# Altium schematic sheet RoBeast_DC_Brake.SchDoc: DC Brake
size A4; ApprovedBy: CR; DrawnBy: VM & IG; Revision: V1; SheetNumber: 9; SheetTotal: 9
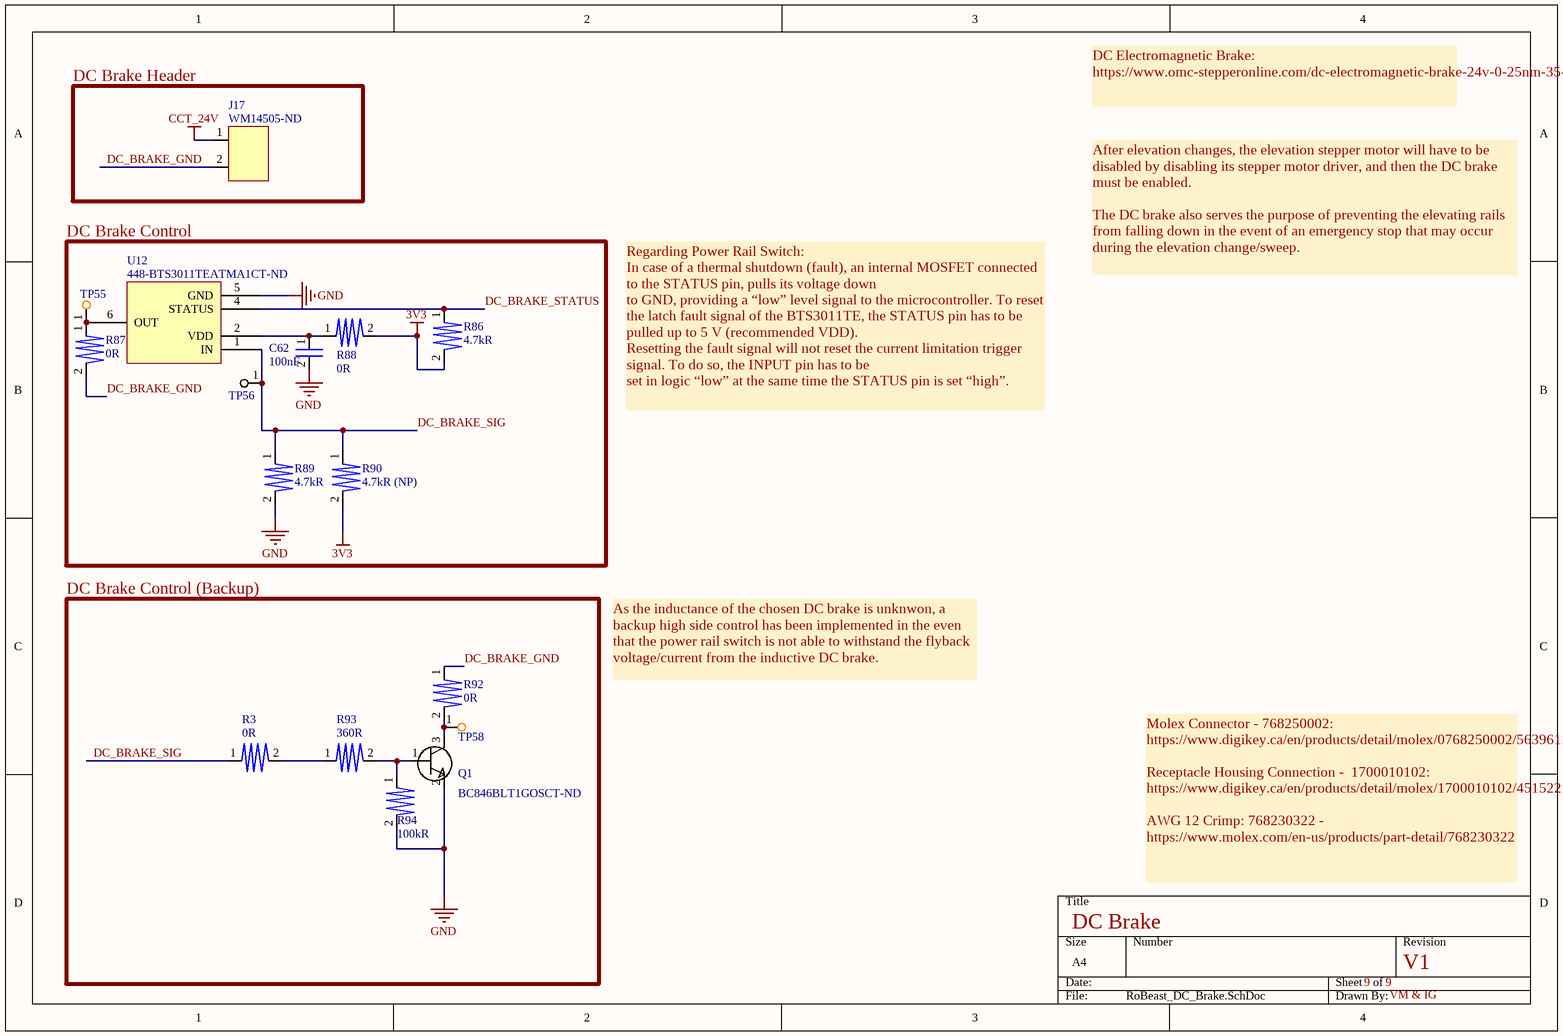
[diagram p0: RoBeast_DC_Brake.SchDoc]

## Parts
C62  100nF  [0805]
J17  2 Pin Connector  [WM14505-ND]  (value not drawn)
Q1  Supplier Part Number 1: BC846BLT1GOSCT-ND  [BC846BLT1G]  (hidden comment: NPN BJT)
R3  0R  [0805]
R86  4.7kR  [0805]
R87  0R  [0805]
R88  0R  [0805]
R89  4.7kR  [0805]
R90  4.7kR (NP)  [0805]
R92  0R  [0805]
R93  360R  [0805]
R94  100kR  [0805]
TP55  Test Point  [Test Point]  (value not drawn)
TP56  Test Point  [RCWCTE]  (value not drawn)
TP58  Test Point  [Test Point]  (value not drawn)
U12  Supplier Part Number 1: 448-BTS3011TEATMA1CT-ND  [BTS3011TEATMA1]  (hidden comment: Power Rail Switch)

## Blocks framed on the sheet
DC Brake Header: J17
DC Brake Control: C62 R86-R90 TP55 TP56 U12
DC Brake Control (Backup): Q1 R3 R92-R94 TP58

## Nets
3V3: R86.2 R88.2 R90.2
CCT_24V: J17.1
GND: C62.2 Q1.2(E) R89.2 R94.2 U12.5(GND)
DC_BRAKE_GND: J17.2 R87.2 R92.1
DC_BRAKE_SIG: R3.1 R89.1 R90.1 TP56.1 U12.1(IN)
DC_BRAKE_STATUS: R86.1 U12.4(STATUS)
NetC62_1: C62.1 R88.1 U12.2(VDD)
NetQ1_1: Q1.1(B) R93.2 R94.1
NetQ1_3: Q1.3(C) R92.2 TP58.1
NetR3_2: R3.2 R93.1
NetR87_1: R87.1 TP55.1 U12.6(OUT)

## Notes on the sheet
- DC Electromagnetic Brake: https://www.omc-stepperonline.com/dc-electromagnetic-brake-24v-0-25nm-35-4oz-in-for-nema-17-stepper-motor-swb-01
- After elevation changes, the elevation stepper motor will have to be disabled by disabling its stepper motor driver, and then the DC brake must be enabled.
  The DC brake also serves the purpose of preventing the elevating rails from falling down in the event of an emergency stop that may occur during the elevation change/sweep.
- Regarding Power Rail Switch:
  In case of a thermal shutdown (fault), an internal MOSFET connected to the STATUS pin, pulls its voltage down
  to GND, providing a “low” level signal to the microcontroller. To reset the latch fault signal of the BTS3011TE, the STATUS pin has to be pulled up to 5 V (recommended VDD).
  Resetting the fault signal will not reset the current limitation trigger signal. To do so, the INPUT pin has to be
  set in logic “low” at the same time the STATUS pin is set “high”.
- As the inductance of the chosen DC brake is unknwon, a backup high side control has been implemented in the even that the power rail switch is not able to withstand the flyback voltage/current from the inductive DC brake.
- Molex Connector - 768250002: https://www.digikey.ca/en/products/detail/molex/0768250002/5639611
  Receptacle Housing Connection -  1700010102: https://www.digikey.ca/en/products/detail/molex/1700010102/4515221
  AWG 12 Crimp: 768230322 - https://www.molex.com/en-us/products/part-detail/768230322

## Library data of the parts
C62 = C0805C104J5RAC7800: Ceramic Capacitor, Multilayer, Ceramic, 50V, 5% +Tol, 5% -Tol, X7R, 15% TC, 0.1uF, Surface Mount, 0805; Manufacturer: KEMET; Manufacturer Part Number: C0805C104J5RACTU; Multilayer: Yes; Supplier 1: Digikey; RoHS: Yes; Category: Ceramic Capacitors; Stock 1: 605061; Pricing 1: 1=0.18, 10=0.122, 50=0.0732, 100=0.0576, 500=0.04252, 1000=0.03519 (USD); Mount: Surface Mount; Number of Pins: 2; Dielectric Material: Ceramic; Package Shape: Rectangular; Size Code: 0805; Terminal Finish: Nickel; Min Operating Temperature: -55°C; Max Operating Temperature: 125°C; JESD-609 Code: e3; Capacitor Type: Ceramic; Negative Tolerance: 5%; Packaging: Tape and Reel; Positive Tolerance: 5%; Rated DC Voltage (URdc): 50V; Temperature Characteristics Code: X7R; Termination: Wraparound; Reach SVHC Compliant: Yes; RoHS Compliant: Yes; ComponentLink1URL: http://capacitoredge.kemet.com:80/capedge2/intellispec.jsp?pn=C0805C104J5RACTU&displayPN=C0805C104J5RACTU&src-supplier=IHS+Markit; ComponentLink1Description: http://capacitoredge.kemet.com:80/capedge2/intellispec.jsp?pn=C0805C104J5RACTU&displayPN=C0805C104J5RACTU&src-supplier=IHS+Markit; ComponentLink2URL: https://datasheet.ciiva.com/7842/1732721-7842179.pdf?src-supplier=Element14; ComponentLink2Description: https://datasheet.ciiva.com/7842/1732721-7842179.pdf?src-supplier=Element14; ComponentLink3URL: https://datasheet.ciiva.com/28682/1851736-28682223.pdf?src-supplier=Element14; ComponentLink3Description: https://datasheet.ciiva.com/28682/1851736-28682223.pdf?src-supplier=Element14; ComponentLink4URL: https://datasheet.ciiva.com/7258/1828800-7258413.pdf?src-supplier=Newark; ComponentLink4Description: https://datasheet.ciiva.com/7258/1828800-7258413.pdf?src-supplier=Newark; ComponentLink5URL: https://datasheet.ciiva.com/14589/70095383-14589015.pdf?src-supplier=Allied+Electronics; ComponentLink5Description: https://datasheet.ciiva.com/14589/70095383-14589015.pdf?src-supplier=Allied+Electronics; ComponentLink6URL: https://datasheet.ciiva.com/5417/kem-c1002-x7r-smd-5417352.pdf?src-supplier=Mouser; ComponentLink6Description: https://datasheet.ciiva.com/5417/kem-c1002-x7r-smd-5417352.pdf?src-supplier=Mouser; ComponentLink7URL: https://datasheet.ciiva.com/39122/docfinderpartnumberc0402c102k5ractu-39122924.pdf?src-supplier=Onlinecomponents.com; ComponentLink7Description: https://datasheet.ciiva.com/39122/docfinderpartnumberc0402c102k5ractu-39122924.pdf?src-supplier=Onlinecomponents.com; Supplier Part Number 1: 399-C0805C104J5RAC7800CT-ND; Capacitance: 100nF
J17 = WM14505-ND: Board Connector, 2 Contact(s), 2 Row(s), Male, Right Angle, Solder Terminal; Manufacturer: Molex; Manufacturer Part Number: 0026013114; Mixed Contacts: No; Number of Contacts: 2; Option: General Purpose; Mating Information: MULTIPLE MATING PARTS AVAILABLE; Supplier: Mouser; RoHS: Yes; Stock: 22788; Pricing: 1=1.12, 10=0.793, 50=0.793, 100=0.704, 1000=0.635, 10000=0.528 (USD); Mounting Technology: Board; Contact Material: Brass; Contact Finish - Mating: GOLD; Contact Finish - Termination: Matte Tin (Sn); Connector Type: BOARD CONNECTOR; JESD-609 Code: e3; Contact Gender: Male; Mounting Style: RIGHT ANGLE; Termination: Solder; Filter Feature: No; Number of Rows Loaded: 2; Flammability Rating: UL94 V-2; Reach SVHC Compliant: Yes; RoHS Compliant: Yes; DIN Conformance: No; IEC Conformance: No; MIL Conformance: No; ComponentLink1URL: https://datasheet.ciiva.com:443/pdfs/VipMasterIC/IC/MOLE/MOLE-S-A0006764423/MOLE-S-A0006865681-1.pdf?src-supplier=IHS+Markit; ComponentLink1Description: https://datasheet.ciiva.com:443/pdfs/VipMasterIC/IC/MOLE/MOLE-S-A0006764423/MOLE-S-A0006865681-1.pdf?src-supplier=IHS+Markit; Supplier 1: Digikey; Supplier Part Number: 538-26-01-3114; Supplier Part Number 1: WM14505-ND
Q1 = BC846BLT1G: Small Signal Bipolar Transistor, 0.1A I(C), 65V V(BR)CEO, 1-Element, NPN, Silicon, TO-236; Manufacturer: ON Semiconductor; Package Body Material: Plastic; Power Dissipation-Max (Abs): 225mW; Max Collector Current: 100mA; DC Current Gain-Min (hFE): 200; Number of Elements: 1; Transition Frequency-Nom (fT): 100MHz; Transistor Application: SWITCHING; Time @ Peak Reflow Temperature-Max (s): 40s; Qualification Status: Not Qualified; Supplier 1: Digikey; Manufacturer Part Number: BC846BLT1G; RoHS: Yes; Category: BJTs; Stock 1: 1618453; Pricing 1: 1=0.14, 10=0.097, 100=0.0522, 500=0.04102, 1000=0.02848 (USD); Number of Pins: 3; Terminal Finish: Tin; Package Shape: Rectangular; Transistor Element Material: SILICON; Max Operating Temperature: 150°C; JESD-609 Code: e3; Polarity/Channel Type: NPN; Moisture Sensitivity Level: 1; Package Style: SMALL OUTLINEMeter; Surface Mount: Yes; Terminal Form: Gull Wing; Terminal Position: DUAL; Collector-emitter Voltage-Max: 65V; JESD-30 Code: R-PDSO-G3; Peak Reflow Temperature (Cel): 260°C; Reach SVHC Compliant: Yes; RoHS Compliant: Yes; JEDEC-95 Code: TO-236; ComponentLink1URL: https://datasheet.ciiva.com:443/pdfs/VipMasterIC/IC/ONSM/ONSM-S-A0009451914/ONSM-S-A0009451914-1.pdf?src-supplier=IHS+Markit; ComponentLink1Description: https://datasheet.ciiva.com:443/pdfs/VipMasterIC/IC/ONSM/ONSM-S-A0009451914/ONSM-S-A0009451914-1.pdf?src-supplier=IHS+Markit; ComponentLink2URL: https://datasheet.ciiva.com/15138/getdatasheetpartid-38790-15138644.pdf?src-supplier=Verical; ComponentLink2Description: https://datasheet.ciiva.com/15138/getdatasheetpartid-38790-15138644.pdf?src-supplier=Verical; ComponentLink3URL: https://datasheet.ciiva.com/27056/2010421-27056146.pdf?src-supplier=Jameco; ComponentLink3Description: https://datasheet.ciiva.com/27056/2010421-27056146.pdf?src-supplier=Jameco; ComponentLink4URL: https://datasheet.ciiva.com/7972/bc846alt1-d-7972189.pdf?src-supplier=Element14; ComponentLink4Description: https://datasheet.ciiva.com/7972/bc846alt1-d-7972189.pdf?src-supplier=Element14
R3 R87 R88 R92 = RMCF0805ZT0R00: Fixed Resistor, Metal Glaze/thick Film, 0.125W, 0ohm, Surface Mount, 0805; Manufacturer: Stackpole Electronics; Rated Power Dissipation (P): 125mW; Rated Temperature: 70°C; Working Voltage: 150V; Package Height: 0.5mm; Package Length: 2mm; Package Width: 1.25mm; Reference Standard: AEC-Q200; Supplier 1: Digikey; Manufacturer Part Number: RMCF0805ZT0R00; RoHS: Yes; Category: Chip SMD Resistors; Stock 1: 1154169; Pricing 1: 1=0.1, 10=0.017, 25=0.0128, 50=0.0096, 100=0.0068, 250=0.00544, 500=0.00436, 1000=0.00321 (USD); Mount: Surface Mount; Number of Pins: 2; Package Shape: Rectangular; Size Code: 0805; Terminal Finish: Nickel; Min Operating Temperature: -55°C; Max Operating Temperature: 155°C; JESD-609 Code: e3; Resistor Type: FIXED RESISTOR; Construction: Rectangular; Package Style: SMTMeter; Packaging: Tape and Reel; Resistance: 0R; Technology: METAL GLAZE/THICK FILM; Termination: Wraparound; Reach SVHC Compliant: Yes; RoHS Compliant: Yes; ComponentLink1URL: https://datasheet.ciiva.com:443/pdfs/VipMasterIC/IC/SEIE/SEIE-S-A0007077258/SEIE-S-A0007077258-1.pdf?src-supplier=IHS+Markit; ComponentLink1Description: https://datasheet.ciiva.com:443/pdfs/VipMasterIC/IC/SEIE/SEIE-S-A0007077258/SEIE-S-A0007077258-1.pdf?src-supplier=IHS+Markit; ComponentLink2URL: https://datasheet.ciiva.com/15193/getdatasheetpartid-360417-15193658.pdf?src-supplier=Verical; ComponentLink2Description: https://datasheet.ciiva.com/15193/getdatasheetpartid-360417-15193658.pdf?src-supplier=Verical; Supplier Part Number 1: RMCF0805ZT0R00CT-ND
R86 R89 R90 = RCC08054K70FKEA: Fixed Resistor, Metal Glaze/thick Film, 0.25W, 4700ohm, 200V, 1% +/-Tol, 100ppm/Cel, Surface Mount, 0805; Manufacturer: Vishay Dale; Supplier 1: Digikey; Manufacturer Part Number: RCC08054K70FKEA; RoHS: Yes; Category: Chip SMD Resistors; Stock 1: 96612; Pricing 1: 1=0.15, 10=0.069, 50=0.0454, 100=0.0385, 500=0.0271, 1000=0.0236 (USD); Supplier Part Number 1: 541-RCC08054K70FKEACT-ND
R93 = RC0805FR-07360RL: Fixed Resistor, Metal Glaze/thick Film, 0.125W, 360ohm, 150V, 1% +/-Tol, 100ppm/Cel, Surface Mount, 0805; Manufacturer: Yageo; Additional Feature: LASER TRIMMABLE; Rated Power Dissipation (P): 125mW; Rated Temperature: 70°C; Temperature Coefficient: 100ppm/°C; Package Height: 0.5mm; Package Length: 2mm; Package Width: 1.25mm; Supplier 1: Digikey; Manufacturer Part Number: RC0805FR-07360RL; RoHS: Yes; Category: Chip SMD Resistors; Stock 1: 62488; Pricing 1: 1=0.1, 10=0.026, 50=0.0162, 100=0.0136, 500=0.00938, 1000=0.0081 (USD); Mount: Surface Mount; Number of Pins: 2; Package Shape: Rectangular; Size Code: 0805; Terminal Finish: Nickel; Min Operating Temperature: -55°C; Max Operating Temperature: 155°C; Tolerance: 1%; JESD-609 Code: e3; Resistor Type: FIXED RESISTOR; Construction: Chip; Package Style: SMTMeter; Packaging: Tape and Reel; Resistance: 360R; Technology: METAL GLAZE/THICK FILM; Termination: Wraparound; Working Voltage: 150V; Reach SVHC Compliant: Yes; RoHS Compliant: Yes; ComponentLink1URL: https://datasheet.ciiva.com:443/pdfs/VipMasterIC/IC/YAGO/YAGO-S-A0008145938/YAGO-S-A0008145938-1.pdf?src-supplier=IHS+Markit; ComponentLink1Description: https://datasheet.ciiva.com:443/pdfs/VipMasterIC/IC/YAGO/YAGO-S-A0008145938/YAGO-S-A0008145938-1.pdf?src-supplier=IHS+Markit; ComponentLink2URL: https://datasheet.ciiva.com/11808/0900766b8106beab-11808261.pdf?src-supplier=Rs; ComponentLink2Description: https://datasheet.ciiva.com/11808/0900766b8106beab-11808261.pdf?src-supplier=Rs; ComponentLink3URL: https://datasheet.ciiva.com/17423/rc0805-17423149.pdf?src-supplier=Future+Electronics; ComponentLink3Description: https://datasheet.ciiva.com/17423/rc0805-17423149.pdf?src-supplier=Future+Electronics; ComponentLink4URL: https://datasheet.ciiva.com/12667/rc0805-12667401.pdf?src-supplier=Mouser; ComponentLink4Description: https://datasheet.ciiva.com/12667/rc0805-12667401.pdf?src-supplier=Mouser; Supplier Part Number 1: 311-360CRCT-ND
R94 = CRCW0805100KFKEAHP: Fixed Resistor, Metal Glaze/thick Film, 0.5W, 100000ohm, 150V, 1% +/-Tol, 100ppm/Cel, Surface Mount, 0805; Manufacturer: Vishay; Manufacturer Series: CRCW-HPE3; Rated Power Dissipation (P): 500mW; Rated Temperature: 70°C; Temperature Coefficient: 100ppm/°C; Package Height: 0.5mm; Package Length: 2mm; Package Width: 1.25mm; Reference Standard: AEC-Q200; Supplier 1: Digikey; Manufacturer Part Number: CRCW0805100KFKEAHP; RoHS: Yes; Category: Chip SMD Resistors; Stock 1: 104274; Pricing 1: 1=0.2, 10=0.103, 50=0.0688, 100=0.0587, 500=0.0421, 1000=0.03706 (USD); Mount: Surface Mount; Number of Pins: 2; Package Shape: Rectangular; Terminal Finish: Nickel; Size Code: 0805; Min Operating Temperature: -55°C; Max Operating Temperature: 155°C; Tolerance: 1%; JESD-609 Code: e3; Package Style: SMTMeter; Technology: METAL GLAZE/THICK FILM; Resistor Type: FIXED RESISTOR; Construction: Chip; Packaging: Tape and Reel; Resistance: 100kR; Series: CRCW-HP E3; Termination: Wraparound; Working Voltage: 150V; Reach SVHC Compliant: Yes; RoHS Compliant: Yes; ComponentLink1URL: https://datasheet.ciiva.com:443/pdfs/VipMasterIC/IC/VISH/VISH-S-A0009391795/VISH-S-A0009391795-1.pdf?src-supplier=IHS+Markit; ComponentLink1Description: https://datasheet.ciiva.com:443/pdfs/VipMasterIC/IC/VISH/VISH-S-A0009391795/VISH-S-A0009391795-1.pdf?src-supplier=IHS+Markit; ComponentLink2URL: https://datasheet.ciiva.com/2475/crcwhpe3-2475664.pdf?src-supplier=Digikey; ComponentLink2Description: https://datasheet.ciiva.com/2475/crcwhpe3-2475664.pdf?src-supplier=Digikey; ComponentLink3URL: https://datasheet.ciiva.com/8982/crcwhpe3-8982333.pdf?src-supplier=Avnet; ComponentLink3Description: https://datasheet.ciiva.com/8982/crcwhpe3-8982333.pdf?src-supplier=Avnet; ComponentLink4URL: https://datasheet.ciiva.com/7777/424479-7777350.pdf?src-supplier=Element14; ComponentLink4Description: https://datasheet.ciiva.com/7777/424479-7777350.pdf?src-supplier=Element14; ComponentLink5URL: https://datasheet.ciiva.com/7777/424479-7777351.pdf?src-supplier=Element14; ComponentLink5Description: https://datasheet.ciiva.com/7777/424479-7777351.pdf?src-supplier=Element14; Supplier Part Number 1: 541-100KTCT-ND
TP56 = RCWCTE: Testing/Accessories; Manufacturer: KOA Speer; Rated Temperature: 70°C; Resistance: 0R; Package Height: 2mm; Package Length: 3.2mm; Package Width: 1.6mm; Reference Standard: AEC-Q200; Supplier 1: Digikey; Manufacturer Part Number: RCWCTE; RoHS: Yes; Category: Chip SMD Resistors; Stock 1: 132357; Pricing 1: 1=0.16, 10=0.137, 25=0.1212, 50=0.1132, 100=0.105, 250=0.09292, 500=0.08888, 1000=0.07272 (USD); Mount: Surface Mount; Number of Pins: 2; Package Shape: Rectangular; Size Code: 1206; Terminal Finish: Copper; Min Operating Temperature: -55°C; Max Operating Temperature: 125°C; JESD-609 Code: e2; Resistor Type: FIXED RESISTOR; Construction: Chip; Package Style: SMTMeter; Packaging: Tape and Reel; Termination: Wraparound; Reach SVHC Compliant: Yes; RoHS Compliant: Yes; ComponentLink1URL: https://datasheet.ciiva.com:443/pdfs/VipMasterIC/IC/KOAS/KOASS03065/KOASS03065-1.pdf?src-supplier=IHS+Markit; ComponentLink1Description: https://datasheet.ciiva.com:443/pdfs/VipMasterIC/IC/KOAS/KOASS03065/KOASS03065-1.pdf?src-supplier=IHS+Markit; ComponentLink2URL: https://datasheet.ciiva.com/34302/1876186-34302940.pdf?src-supplier=Jameco; ComponentLink2Description: https://datasheet.ciiva.com/34302/1876186-34302940.pdf?src-supplier=Jameco; ComponentLink3URL: https://datasheet.ciiva.com/5556/rc-5556236.pdf?src-supplier=Mouser; ComponentLink3Description: https://datasheet.ciiva.com/5556/rc-5556236.pdf?src-supplier=Mouser; ComponentLink4URL: https://datasheet.ciiva.com/26821/getdatasheetpartid-110197-26821157.pdf?src-supplier=Verical; ComponentLink4Description: https://datasheet.ciiva.com/26821/getdatasheetpartid-110197-26821157.pdf?src-supplier=Verical; Supplier Part Number 1: 2019-RCWCTECT-ND
U12 = BTS3011TEATMA1: Current Limit SW 1-IN 1-OUT 3V to 5.5V 10A Automotive 7-Pin(6+Tab) D2PAK T/R; Manufacturer: Infineon; Supplier 1: Digikey; Manufacturer Part Number: BTS3011TEATMA1; RoHS: Yes; Category: Power Management ICs; Stock 1: 16298; Pricing 1: 1=2.62, 10=2.353, 25=2.2196, 100=1.891, 250=1.7756, 500=1.55364, 1000=1.2873 (USD); Reach SVHC Compliant: No; ComponentLink1URL: https://datasheet.ciiva.com:443/pdfs/VipMasterIC/IC/INFN/INFN-S-A0006623395/INFN-S-A0006623395-1.pdf?src-supplier=IHS+Markit; ComponentLink1Description: https://datasheet.ciiva.com:443/pdfs/VipMasterIC/IC/INFN/INFN-S-A0006623395/INFN-S-A0006623395-1.pdf?src-supplier=IHS+Markit